# Altium schematic sheet PAGE1-MCU,USB,ADC.SchDoc (part 1 of 2)
size A3; DocumentNumber: 1; SheetNumber: 1; SheetTotal: 2
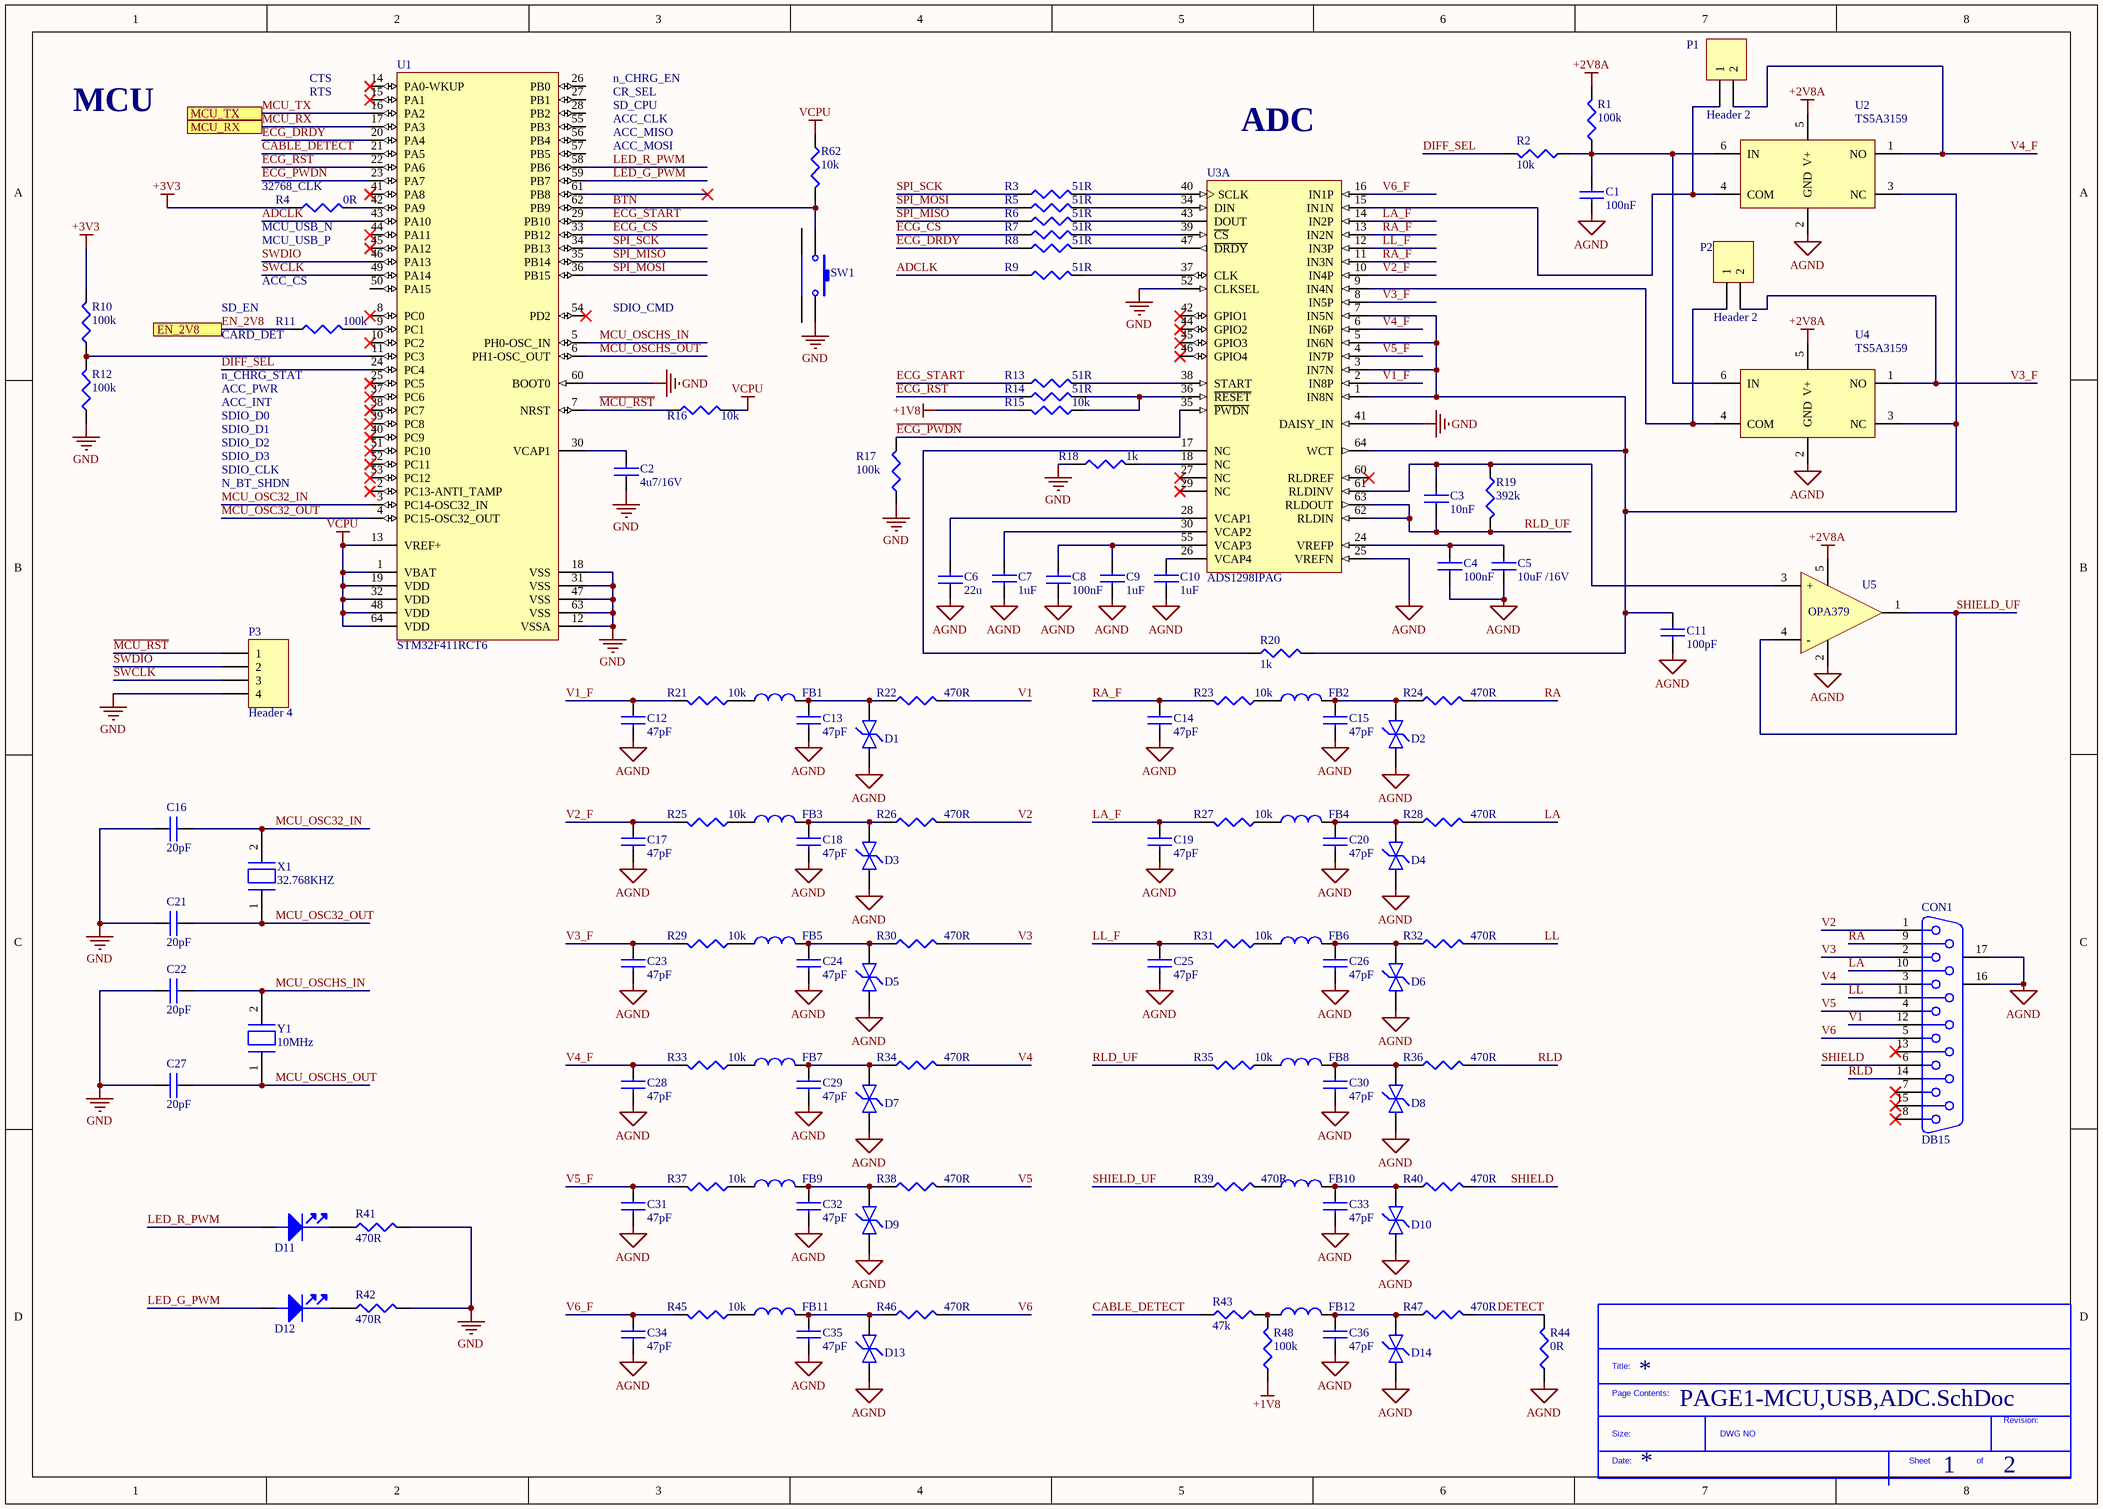
[diagram p0: PAGE1-MCU,USB,ADC.SchDoc]

## Parts
*?  SDTitleBlock  (value not drawn)  (graphical)
C1  100nF  [CAP0603]
C2  4u7/16V  [CAP0603]
C3  10nF  [CAP0603]
C4  100nF  [CAP0603]
C5  10uF /16V  [CAP0805]
C6  22u  [CAP0805]
C7  1uF  [CAP0603]
C8  100nF  [CAP0603]
C9  1uF  [CAP0603]
C10  1uF  [CAP0603]
C11  100pF  [CAP0603]
C12  47pF  [CAP0603]
C13  47pF  [CAP0603]
C14  47pF  [CAP0603]
C15  47pF  [CAP0603]
C16  20pF  [CAP0603]
C17  47pF  [CAP0603]
C18  47pF  [CAP0603]
C19  47pF  [CAP0603]
C20  47pF  [CAP0603]
C21  20pF  [CAP0603]
C22  20pF  [CAP0603]
C23  47pF  [CAP0603]
C24  47pF  [CAP0603]
C25  47pF  [CAP0603]
C26  47pF  [CAP0603]
C27  20pF  [CAP0603]
C28  47pF  [CAP0603]
C29  47pF  [CAP0603]
C30  47pF  [CAP0603]
C31  47pF  [CAP0603]
C32  47pF  [CAP0603]
C33  47pF  [CAP0603]
C34  47pF  [CAP0603]
C35  47pF  [CAP0603]
C36  47pF  [CAP0603]
CON1  DB15  [CONN_3-106506-2_ - vertical]
D1  TPD1E10B06DPYR  [D0402]  (value not drawn)
D2  TPD1E10B06DPYR  [D0402]  (value not drawn)
D3  TPD1E10B06DPYR  [D0402]  (value not drawn)
D4  TPD1E10B06DPYR  [D0402]  (value not drawn)
D5  TPD1E10B06DPYR  [D0402]  (value not drawn)
D6  TPD1E10B06DPYR  [D0402]  (value not drawn)
D7  TPD1E10B06DPYR  [D0402]  (value not drawn)
D8  TPD1E10B06DPYR  [D0402]  (value not drawn)
D9  TPD1E10B06DPYR  [D0402]  (value not drawn)
D10  TPD1E10B06DPYR  [D0402]  (value not drawn)
D11  LED RED  [LED0603]  (value not drawn)
D12  LED RED  [LED0603]  (value not drawn)
D13  TPD1E10B06DPYR  [D0402]  (value not drawn)
D14  TPD1E10B06DPYR  [D0402]  (value not drawn)
FB1  BLM15PG100SN1D  [IND0402]  (value not drawn)
FB2  BLM15PG100SN1D  [IND0402]  (value not drawn)
FB3  BLM15PG100SN1D  [IND0402]  (value not drawn)
FB4  BLM15PG100SN1D  [IND0402]  (value not drawn)
FB5  BLM15PG100SN1D  [IND0402]  (value not drawn)
FB6  BLM15PG100SN1D  [IND0402]  (value not drawn)
FB7  BLM15PG100SN1D  [IND0402]  (value not drawn)
FB8  BLM15PG100SN1D  [IND0402]  (value not drawn)
FB9  BLM15PG100SN1D  [IND0402]  (value not drawn)
FB10  BLM15PG100SN1D  [IND0402]  (value not drawn)
FB11  BLM15PG100SN1D  [IND0402]  (value not drawn)
FB12  BLM15PG100SN1D  [IND0402]  (value not drawn)
P1  Header 2  [HDR1X2]  (no BOM)
P2  Header 2  [HDR1X2]  (no BOM)
P3  Header 4  [HDR1X4]  (no BOM)
R1  100k  [RES0603]
R2  10k  [RES0603]
R3  51R  [RES0603]
R4  0R  [RES0603]
R5  51R  [RES0603]
R6  51R  [RES0603]
R7  51R  [RES0603]
R8  51R  [RES0603]
R9  51R  [RES0603]
R10  100k  [RES0603]
R11  100k  [RES0603]
R12  100k  [RES0603]
R13  51R  [RES0603]
R14  51R  [RES0603]
R15  10k  [RES0603]
R16  10k  [RES0603]
R17  100k  [RES0603]
R18  1k  [RES0603]
R19  392k  [RES0603]
R20  1k  [RES0603]
R21  10k  [RES0603]
R22  470R  [RES0603]
R23  10k  [RES0603]
R24  470R  [RES0603]
R25  10k  [RES0603]
R26  470R  [RES0603]
R27  10k  [RES0603]
R28  470R  [RES0603]
R29  10k  [RES0603]
R30  470R  [RES0603]
R31  10k  [RES0603]
R32  470R  [RES0603]
R33  10k  [RES0603]
R34  470R  [RES0603]
R35  10k  [RES0603]
R36  470R  [RES0603]
R37  10k  [RES0603]
R38  470R  [RES0603]
R39  470R  [RES0603]
R40  470R  [RES0603]
R41  470R  [RES0603]
R42  470R  [RES0603]
R43  47k  [RES0603]
R44  0R  [RES0603]
R45  10k  [RES0603]
R46  470R  [RES0603]
R47  470R  [RES0603]
R48  100k  [RES0603]
R62  10k  [RES0603]
SW1  PTS645VH58-2LFS  [SW TH ANGLE_2]  (value not drawn)
U1  STM32F411RCT6  [TSQFP50P1200X1200X160-64N]
U2  TS5A3159  [SOT95P280X145-6N]
U3  ADS1298IPAG  [TSQFP50P1200X1200X120-64N]  (part A of 2)
U4  TS5A3159  [SOT95P280X145-6N]
U5  OPA379  [SOT95P280X145-5N]
X1  32.768KHZ  [CRY2X1.2]
Y1  10MHz  [CRYSTAL6mmx3.5mm]

## Ports
EN_2V8, MCU_RX, MCU_TX

## Nets
+1V8: R15.2 R48.1
+2V8A: R1.2 U2.5(V+) U4.5(V+) U5.5
+3V3: R4.1 R10.2
AGND: C1.1 C4.1 C5.1 C6.1 C7.2 C8.1 C9.2 C10.2 C11.2 C12.2 C13.2 C14.2 C15.2 C17.2 C18.2 C19.2 C20.2 C23.2 C24.2 C25.2 C26.2 C28.2 C29.2 C30.2 C31.2 C32.2 C33.2 C34.2 C35.2 C36.2 CON1.16(MH1) CON1.17(MH2) D1.2 D2.2 D3.2 D4.2 D5.2 D6.2 D7.2 D8.2 D9.2 D10.2 D13.2 D14.2 R44.1 U2.2(GND) U3.25(VREFN) U4.2(GND) U5.2
GND: C2.1 C16.1 C21.1 C22.1 C27.1 P3.4 R12.1 R17.1 R18.1 R41.2 R42.2 SW1.2 U1.12(VSSA) U1.18(VSS) U1.31(VSS) U1.47(VSS) U1.60(BOOT0) U1.63(VSS) U3.41(DAISY_IN) U3.52(CLKSEL)
VCPU: R16.2 R62.1 U1.1(VBAT) U1.13(VREF+) U1.19(VDD) U1.32(VDD) U1.48(VDD) U1.64(VDD)
ADCLK: R9.1 U1.43(PA10)
BTN: R62.2 SW1.1 U1.62(PB9)
CABLE_DETECT: R43.1 U1.21(PA5)
DETECT: R44.2 R47.2
DIFF_SEL: R2.2 U1.24(PC4)
~{ECG_CS}: R7.1 U1.33(PB12)
~{ECG_DRDY}: R8.1 U1.20(PA4)
~{ECG_PWDN}: R17.2 U1.23(PA7) U3.35(~{PWDN})
~{ECG_RST}: R14.1 U1.22(PA6)
ECG_START: R13.1 U1.29(PB10)
EN_2V8: R11.1 ; port EN_2V8
LA: CON1.10 R28.2
LA_F: C19.1 R27.2 U3.14(IN2P)
LED_G_PWM: D12.2(ANODE) U1.59(PB7)
LED_R_PWM: D11.2(ANODE) U1.58(PB6)
LL: CON1.11 R32.2
LL_F: C25.1 R31.2 U3.12(IN3P)
~{MCU_RST}: P3.1 R16.1 U1.7(NRST)
MCU_OSC32_IN: C16.2 U1.3(PC14-OSC32_IN) X1.2
MCU_OSC32_OUT: C21.2 U1.4(PC15-OSC32_OUT) X1.1
MCU_OSCHS_IN: C22.2 U1.5(PH0-OSC_IN) Y1.2
MCU_OSCHS_OUT: C27.2 U1.6(PH1-OSC_OUT) Y1.1
MCU_RX: U1.17(PA3) ; port MCU_RX
MCU_TX: U1.16(PA2) ; port MCU_TX
RA: CON1.9 R24.2
RA_F: C14.1 R23.2 U3.11(IN3N) U3.13(IN2N)
RLD: CON1.14 R36.2
RLD_UF: C3.1 R19.2 R35.2 U3.62(RLDIN) U3.63(RLDOUT)
SHIELD: CON1.6 R40.2
SHIELD_UF: R39.1 U5.1 U5.4(-)
SPI_MISO: R6.1 U1.35(PB14)
SPI_MOSI: R5.1 U1.36(PB15)
SPI_SCK: R3.1 U1.34(PB13)
SWCLK: P3.3 U1.49(PA14)
SWDIO: P3.2 U1.46(PA13)
V1: CON1.12 R22.2
V1_F: C12.1 R21.2 U3.2(IN8P)
V2: CON1.1 R26.2
V2_F: C17.1 R25.2 U3.10(IN4P)
V3: CON1.2 R30.2
V3_F: C23.1 P2.2 R29.2 U3.8(IN5P) U4.1(NO)
V4: CON1.3 R34.2
V4_F: C28.1 P1.2 R33.2 U2.1(NO) U3.6(IN6P)
V5: CON1.4 R38.2
V5_F: C31.1 R37.2 U3.4(IN7P)
V6: CON1.5 R46.2
V6_F: C34.1 R45.2 U3.16(IN1P)
NetC1_2: C1.2 R1.1 R2.1 U2.6(IN) U4.6(IN)
NetC2_2: C2.2 U1.30(VCAP1)
NetC3_2: C3.2 R19.1 U3.61(RLDINV) U5.3(+)
NetC4_2: C4.2 C5.2 U3.24(VREFP)
NetC6_2: C6.2 U3.28(VCAP1)
NetC7_1: C7.1 U3.30(VCAP2)
NetC8_2: C8.2 C9.1 U3.55(VCAP3)
NetC10_1: C10.1 U3.26(VCAP4)
NetC11_1: C11.1 R20.2 U2.3(NC) U3.1(IN8N) U3.3(IN7N) U3.5(IN6N) U3.7(IN5N) U3.64(WCT) U4.3(NC)
NetC13_1: C13.1 D1.1 FB1.2 R22.1
NetC15_1: C15.1 D2.1 FB2.2 R24.1
NetC18_1: C18.1 D3.1 FB3.2 R26.1
NetC20_1: C20.1 D4.1 FB4.2 R28.1
NetC24_1: C24.1 D5.1 FB5.2 R30.1
NetC26_1: C26.1 D6.1 FB6.2 R32.1
NetC29_1: C29.1 D7.1 FB7.2 R34.1
NetC30_1: C30.1 D8.1 FB8.2 R36.1
NetC32_1: C32.1 D9.1 FB9.2 R38.1
NetC33_1: C33.1 D10.1 FB10.2 R40.1
NetC35_1: C35.1 D13.1 FB11.2 R46.1
NetC36_1: C36.1 D14.1 FB12.2 R47.1
NetD11_1: D11.1(cathode) R41.1
NetD12_1: D12.1(cathode) R42.1
NetFB1_1: FB1.1 R21.1
NetFB2_1: FB2.1 R23.1
NetFB3_1: FB3.1 R25.1
NetFB4_1: FB4.1 R27.1
NetFB5_1: FB5.1 R29.1
NetFB6_1: FB6.1 R31.1
NetFB7_1: FB7.1 R33.1
NetFB8_1: FB8.1 R35.1
NetFB9_1: FB9.1 R37.1
NetFB10_1: FB10.1 R39.2
NetFB11_1: FB11.1 R45.1
NetFB12_1: FB12.1 R43.2 R48.2
NetP1_1: P1.1 U2.4(COM) U3.15(IN1N)
NetP2_1: P2.1 U3.9(IN4N) U4.4(COM)
NetR3_2: R3.2 U3.40(SCLK)
NetR4_2: R4.2 U1.42(PA9)
NetR5_2: R5.2 U3.34(DIN)
NetR6_2: R6.2 U3.43(DOUT)
NetR7_2: R7.2 U3.39(~{CS})
NetR8_2: R8.2 U3.47(~{DRDY})
NetR9_2: R9.2 U3.37(CLK)
NetR10_1: R10.1 R12.2 U1.11(PC3)
NetR11_2: R11.2 U1.9(PC1)
NetR13_2: R13.2 U3.38(START)
NetR14_2: R14.2 R15.1 U3.36(~{RESET})
NetR18_2: R18.2 U3.18(NC)
NetR20_1: R20.1 U3.17(NC)

Not connected (* = marked no-connect by the designer): CON1 7* 8* 13* 15*; SW1 3 4; U1 2(PC13-ANTI_TAMP)* 8(PC0)* 10(PC2)* 14(PA0-WKUP)* 15(PA1)* 25(PC5)* 26(PB0) 27(PB1) 28(PB2) 37(PC6)* 38(PC7)* 39(PC8)* 40(PC9)* 41(PA8)* 44(PA11)* 45(PA12)* 50(PA15) 51(PC10)* 52(PC11)* 53(PC12)* 54(PD2)* 55(PB3) 56(PB4) 57(PB5) 61(PB8)*; U3 27(NC)* 29(NC)* 42(GPIO1)* 44(GPIO2)* 45(GPIO3)* 46(GPIO4)* 60(RLDREF)*

## Notes on the sheet
- CTS
- RTS
- n_CHRG_EN
- CR_SEL
- SD_CPU
- MCU
- ACC_CLK
- ACC_MISO
- ACC_MOSI
- ADC
- (near R4) 32768_CLK
- (near R4) MCU_USB_N
- (near R4) MCU_USB_P
- (near R11) SD_EN
- (near R11) ACC_CS
- SDIO_CMD
- (near R11) n_CHRG_STAT
- (near R11) CARD_DET
- ACC_PWR
- ACC_INT
- SDIO_D0
- SDIO_D1
- SDIO_D2
- N_BT_SHDN
- SDIO_D3
- SDIO_CLK
- (in symbol SDTitleBlock) Title:; Page Contents:; Revision:; Size:; DWG NO; Date:; Sheet; of